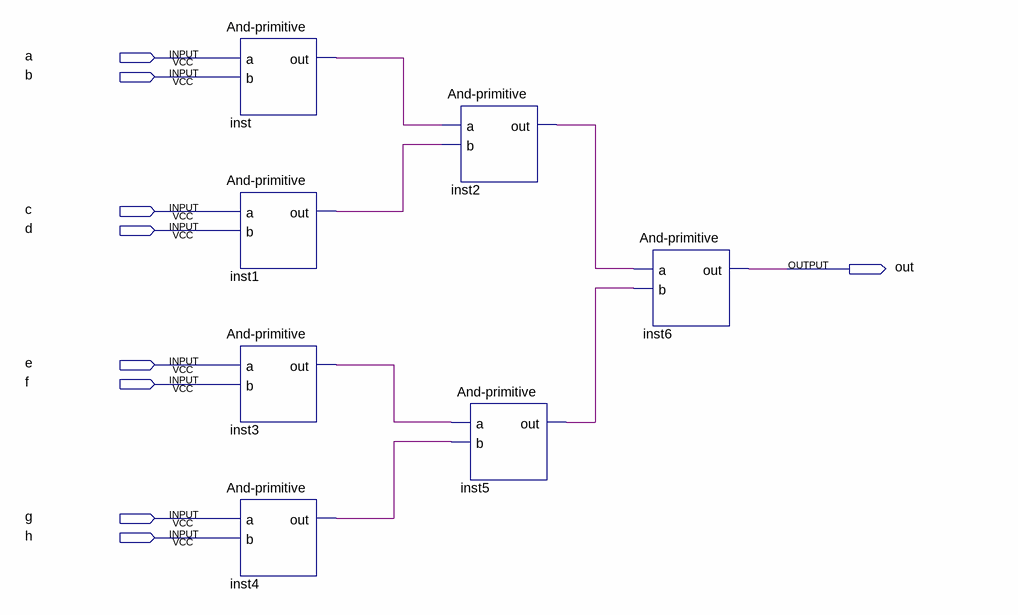
[diagram p0: schematic sheet]
// Quartus schematic And8-primitive.bdf as structural Verilog: 7 symbols, 9 pins
module \And8-primitive  (
  input  a,
  input  b,
  input  c,
  input  d,
  input  e,
  input  f,
  input  g,
  input  h,
  output out
);

  wire inst1_out, inst2_out, inst3_out, inst4_out, inst5_out, inst_out;

  \And-primitive  inst (.a(a), .b(b), .out(inst_out));
  \And-primitive  inst1 (.a(c), .b(d), .out(inst1_out));
  \And-primitive  inst3 (.a(e), .b(f), .out(inst3_out));
  \And-primitive  inst4 (.a(g), .b(h), .out(inst4_out));
  \And-primitive  inst2 (.a(inst_out), .b(inst1_out), .out(inst2_out));
  \And-primitive  inst5 (.a(inst3_out), .b(inst4_out), .out(inst5_out));
  \And-primitive  inst6 (.a(inst2_out), .b(inst5_out), .out(out));
endmodule
